# EAGLE design bot (EAGLE 9.4.2)
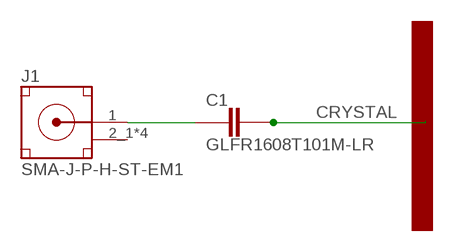
[diagram p0: schematic, sheet 1]

## Parts
C1  GLFR1608T101M-LR  [CAPC1608X95]
J1  SMA-J-P-H-ST-EM1  [SMA-J-P-H-ST-EM1]

## Nets
CRYSTAL: C1.2
N$1: C1.1 J1.1(SIGNAL)

## Power pins joined to a net without a drawn wire
GND: J1.2_1(GND) J1.2_2(GND) J1.3_1(GND) J1.3_2(GND)

## Library data of the parts
C1 = GLFR1608T101M-LR:GLFR1608T101M-LR: FIXED IND 100UH 80MA 5.5 OHM SMD; DESCRIPTION: Inductor Power Chip Shielded Wirewound 100uH 20% 80mA 5.5Ohm DCR 0603 T/R; DIGI-KEY_PART_NUMBER: 445-6150-1-ND; DIGI-KEY_PURCHASE_URL: https://www.digikey.com/product-detail/en/tdk-corporation/GLFR1608T101M-LR/445-6150-1-ND/2465476?utm_source=snapeda&utm_medium=aggregator&utm_campaign=symbol; MF: TDK; MP: GLFR1608T101M-LR; PACKAGE: 0603 TDK
J1 = SMA-J-P-H-ST-EM1:SMA-J-P-H-ST-EM1: Connector SMA F 50Ohm Solder ST Edge Mount Gold Over Nickel Tray; DESCRIPTION: Connector SMA F 50Ohm Solder ST Edge Mount Gold Over Nickel Tray; DIGI-KEY_PART_NUMBER: SAM8857-ND; DIGI-KEY_PURCHASE_URL: https://www.digikey.com/product-detail/en/samtec-inc/SMA-J-P-H-ST-EM1/SAM8857-ND/2602450?utm_source=snapeda&utm_medium=aggregator&utm_campaign=symbol; MF: Samtec; MP: SMA-J-P-H-ST-EM1; PACKAGE: None

## Module 1
Ports: 

### Library data of the parts

## Board
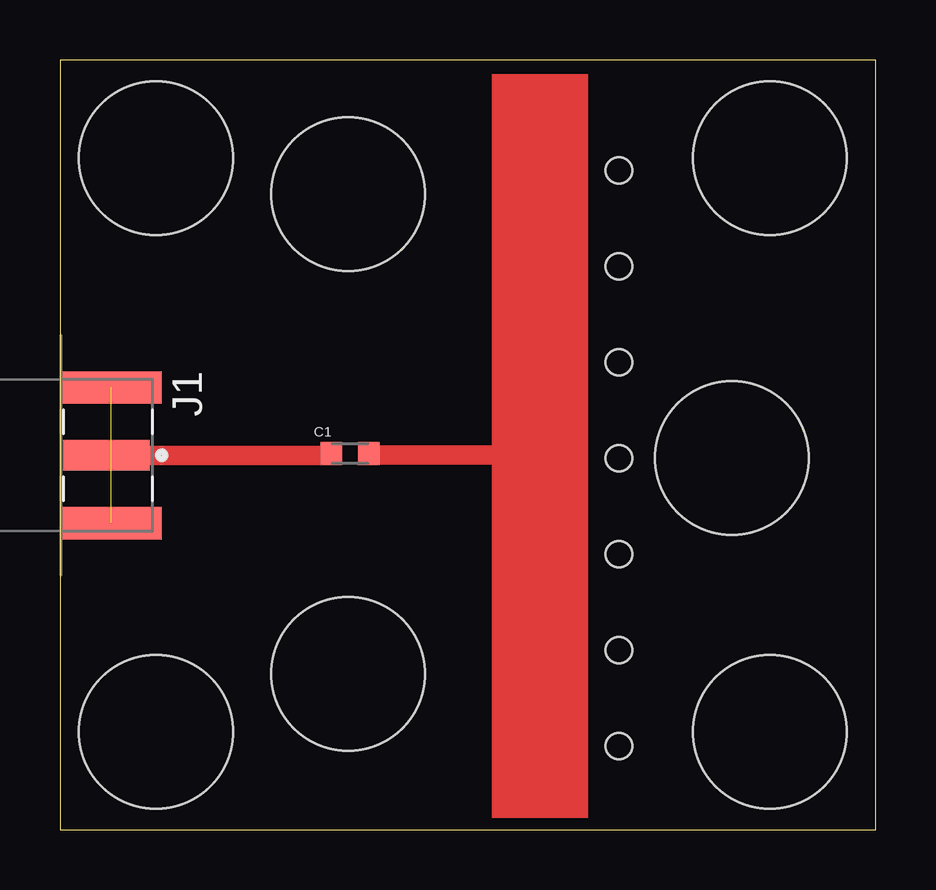
[diagram p1: board, top side]
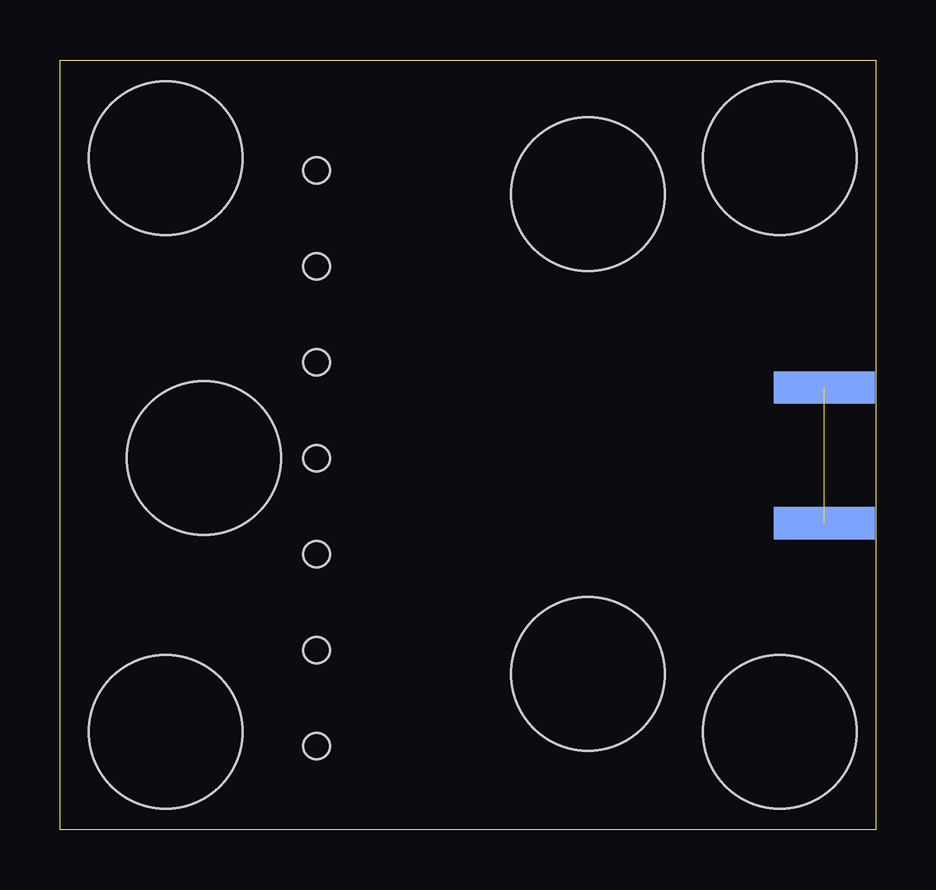
[diagram p2: board, bottom side, seen from below]

Size 34 x 32.1 mm. Coordinates in mm from the lower left corner, seen from the top.
Outline: 0,0 34,0 34,32.1 0,32.1 0,0
Copper layers (1*16): Top 0.035mm / dielectric 1.5mm / Bottom 0.035mm
Design rules "default": minimum track width 6mil, minimum drill 0.35mm, track to track 6mil, track to pad 6mil, pad to pad 6mil, via to via 6mil, smd to smd 6mil, copper to edge 40mil, drill to drill 6mil, minimum pad ring 10mil, minimum via ring 8mil, stop-mask expansion 4mil, vias tented up to drill 0mil, thermal gap 10mil
Holes 6.4 mm at 12,6.5 12,26.5 28,15.5 4,28 4,4.1 29.6,4.1 29.6,28
Holes 1.1 mm at 23.3,15.5 23.3,19.5 23.3,23.5 23.3,27.5 23.3,11.5 23.3,7.5 23.3,3.5

### Footprints (pad centres in the part's own frame; a part is rotated, then mirrored left to right if it is on the bottom)
CAPC1608X95 = smd 0.9 x 0.97: 1 -0.785,0; 2 0.785,0
SMA-J-P-H-ST-EM1 = smd 1.27 x 3.6: 1 0,0 | smd 1.35 x 4.2: 2_1 -2.825,0.2; 3_1 2.825,0.2 | smd 1.35 x 4.2 bottom: 2_2 -2.825,0.2; 3_2 2.825,0.2

### Placement (x,y rotation side)
C1  12.09,15.69 0 top
J1  1.94,15.62 270 top

### Tracks (layer width: path | path; a pad name or v marks a point on that pad's centre or on a via)
CRYSTAL
  Top 0.813: 19.59,15.63 12.94,15.63 C1.2
GND  (3 unrouted)
N$1
  Top 0.813: J1.1 11.23,15.62 C1.1
(copper drawn outside any net)
  shapes: Top area x1